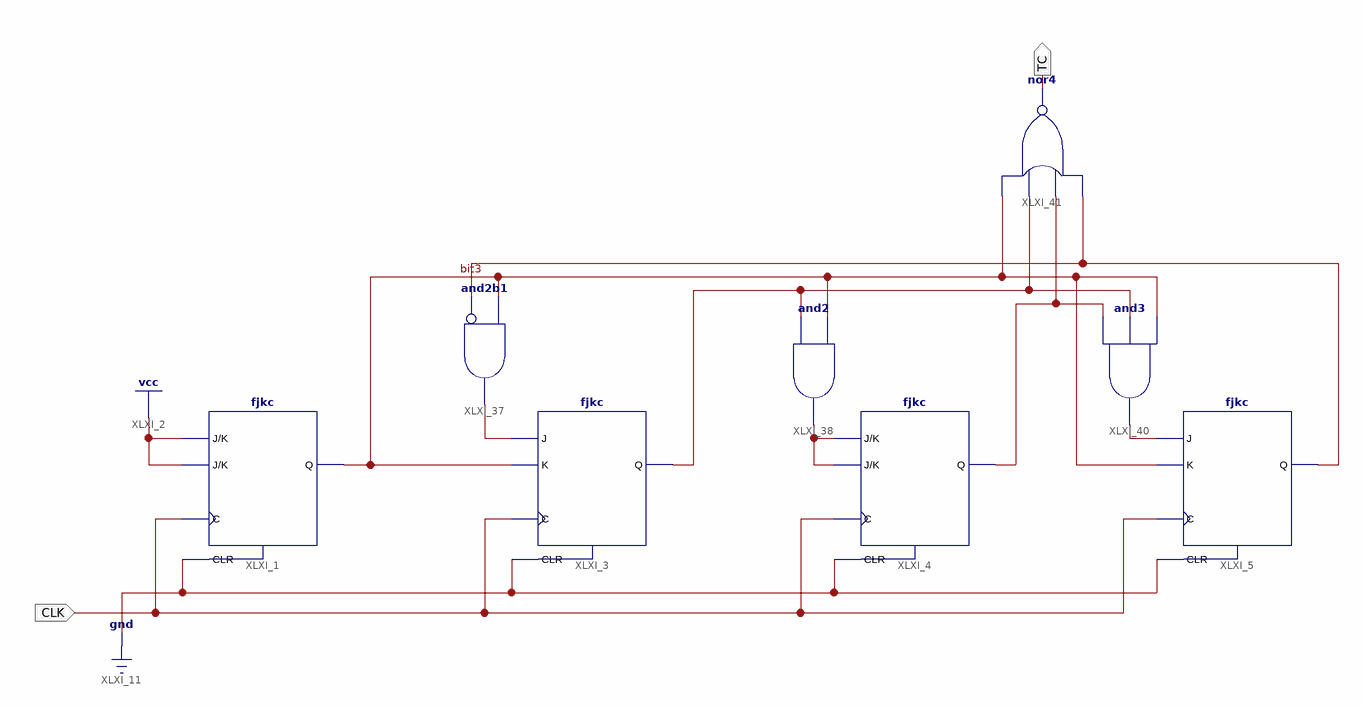
[diagram p0: schematic sheet 1]
// Xilinx ISE schematic mod10.sch (spartan6) as structural Verilog: 8 symbols, 2 ports
module mod10 (
  input  CLK,
  output TC
);

  wire bit0, bit1, bit2, bit3, XLXN_62, XLXN_63, XLXN_65;

  fjkc XLXI_1 (.C(CLK), .CLR(1'b0), .J(1'b1), .K(1'b1), .Q(bit3));
  fjkc XLXI_3 (.C(CLK), .CLR(1'b0), .J(XLXN_62), .K(bit3), .Q(bit2));
  fjkc XLXI_4 (.C(CLK), .CLR(1'b0), .J(XLXN_63), .K(XLXN_63), .Q(bit1));
  fjkc XLXI_5 (.C(CLK), .CLR(1'b0), .J(XLXN_65), .K(bit3), .Q(bit0));
  and XLXI_37 (XLXN_62, ~bit0, bit3);  // and2b1
  and XLXI_38 (XLXN_63, bit2, bit3);
  and XLXI_40 (XLXN_65, bit1, bit2, bit3);
  nor XLXI_41 (TC, bit0, bit1, bit2, bit3);
endmodule
